# EAGLE design F3N-ADXL377-BREAKOUT (EAGLE 6.5.0)
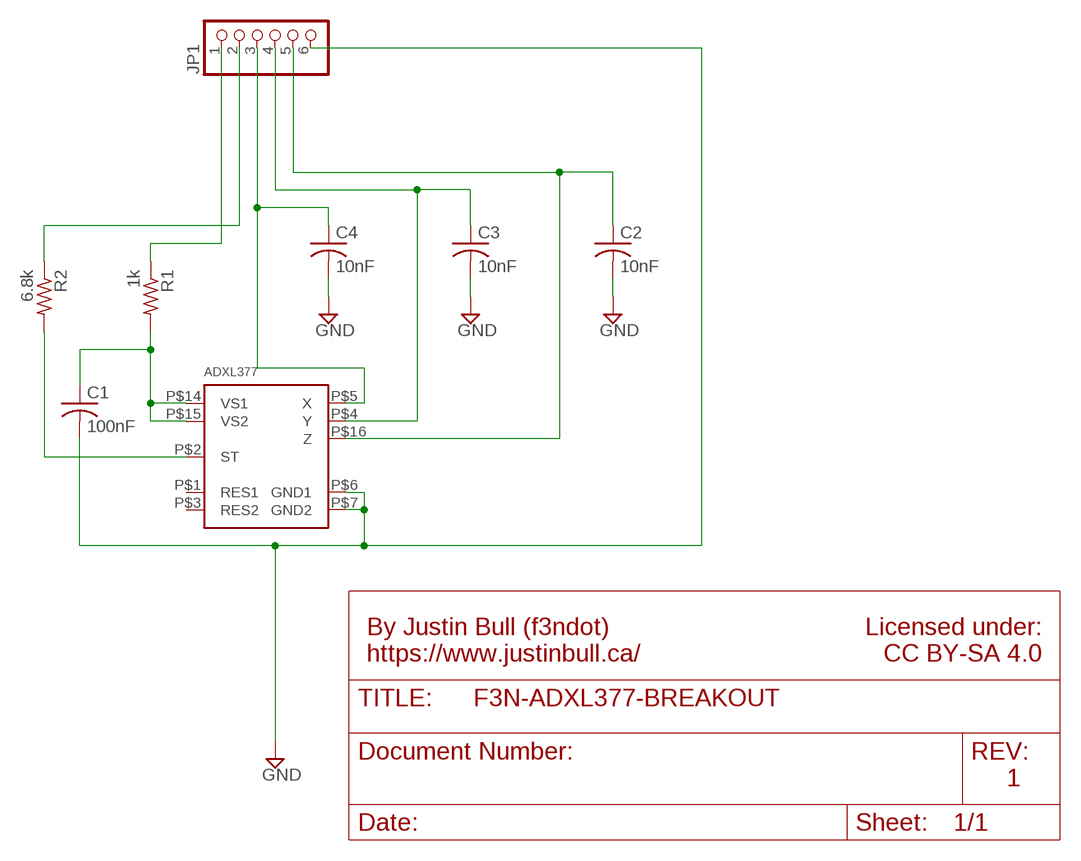
[diagram p0: schematic, sheet 1]

## Parts
ADXL377  ACCEL_ADXL377LFCSP_LQ  [LFCSP_LQ_CP-16-28]
C1  100nF  C-US050-030X075  [C050-030X075]
C2  10nF  C-US050-030X075  [C050-030X075]
C3  10nF  C-US050-030X075  [C050-030X075]
C4  10nF  C-US050-030X075  [C050-030X075]
JP1  PINHD-1X6  [1X06]
R1  1k  R-US_0204/7  [0204/7]
R2  6.8k  R-US_0204/7  [0204/7]

## Nets
GND: ADXL377.P$6(GND1) ADXL377.P$7(GND2) C1.2 C2.2 C3.2 C4.2 JP1.6
N$4: ADXL377.P$14(VS1) ADXL377.P$15(VS2) C1.1 R1.2
N$9: ADXL377.P$2(ST) R2.2
ST: JP1.2 R2.1
VS: JP1.1 R1.1
X: ADXL377.P$5(X) C4.1 JP1.3
Y: ADXL377.P$4(Y) C3.1 JP1.4
Z: ADXL377.P$16(Z) C2.1 JP1.5
Unconnected: ADXL377.P$1(RES1) ADXL377.P$3(RES2)

## Notes on the sheet
- By Justin Bull (f3ndot)
  https://www.justinbull.ca/
- Licensed under:
  CC BY-SA 4.0
- 1

## Library data of the parts
ADXL377 = adxl377:ACCEL_ADXL377: ADXL377 LFCSP_LQ (CP-16-28) From Analog Devices. Datasheet <http://www.analog.com/static/imported-files/data_sheets/ADXL377.pdf>
C1-C4 = rcl:C-US: CAPACITOR, American symbol
JP1 = adafruit:PINHD-1X6: PIN HEADER
R1 R2 = adafruit:R-US_: RESISTOR, American symbol

## Board
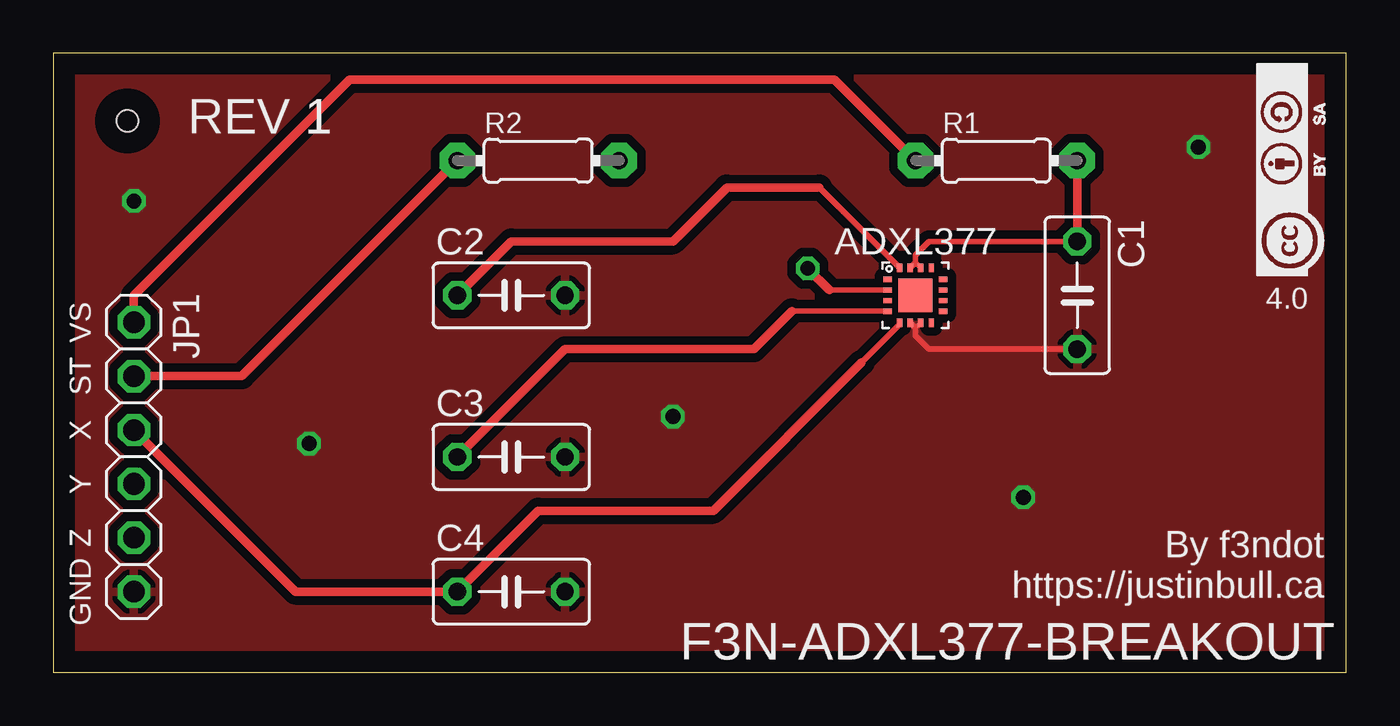
[diagram p1: board, top side]
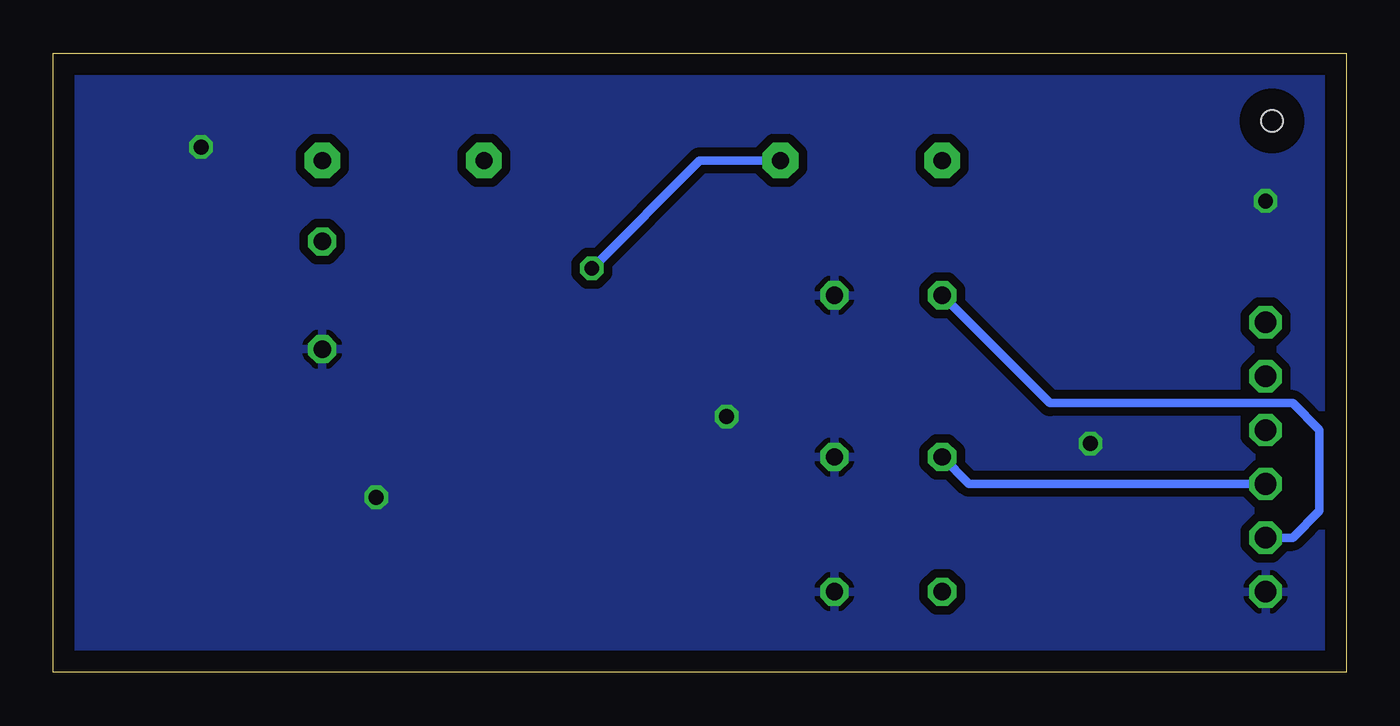
[diagram p2: board, bottom side, seen from below]

Size 60.95 x 29.2 mm. Coordinates in mm from the lower left corner, seen from the top.
Outline: 0,0 60.95,0 60.95,29.2 0,29.2 0,0
Copper layers (1*16): Top 0.035mm / dielectric 1.5mm / Bottom 0.035mm
Design rules "default": minimum track width 10mil, minimum drill 24mil, track to track 8mil, track to pad 8mil, pad to pad 8mil, via to via 8mil, smd to smd 8mil, copper to edge 40mil, drill to drill 8mil, minimum pad ring 10mil, minimum via ring 8mil, stop-mask expansion 4mil, vias tented up to drill 0mil, thermal gap 10mil
Holes 1 mm at 3.5,26

### Footprints (pad centres in the part's own frame; a part is rotated, then mirrored left to right if it is on the bottom)
LFCSP_LQ_CP-16-28 = smd 1.6 x 1.6: EXP 0,0 | smd 0.4 x 0.25: P$1 -1.3,0.75; P$2 -1.3,0.25; P$3 -1.3,-0.25; P$4 -1.3,-0.75; P$9 1.3,-0.75; P$10 1.3,-0.25; P$11 1.3,0.25; P$12 1.3,0.75 | smd 0.25 x 0.4: P$5 -0.75,-1.3; P$6 -0.25,-1.3; P$7 0.25,-1.3; P$8 0.75,-1.3; P$13 0.75,1.3; P$14 0.25,1.3; P$15 -0.25,1.3; P$16 -0.75,1.3
C050-030X075 = drill 0.813 octagon: 1 -2.54,0; 2 2.54,0
1X06 = drill 1.016 octagon: 1 -6.35,0; 2 -3.81,0; 3 -1.27,0; 4 1.27,0; 5 3.81,0; 6 6.35,0
0204/7 = drill 0.813 pad 1.676 octagon: 1 -3.81,0; 2 3.81,0

### Placement (x,y rotation side)
ADXL377  40.64,17.78 0 top
C1  48.26,17.78 270 top
C2  21.59,17.78 0 top
C3  21.59,10.16 0 top
C4  21.59,3.81 0 top
JP1  3.81,10.16 270 top
R1  44.45,24.13 0 top
R2  22.86,24.13 0 top

### Tracks (layer width: path | path; a pad name or v marks a point on that pad's centre or on a via)
GND  (via drill 0.7)
  Top 0.254: C1.2 41.27,15.24 40.64,15.88 40.64,16.23 | 40.64,16.23 ADXL377.P$6 | ADXL377.P$7 40.64,16.23
  other vias: 3.81,22.23 53.98,24.77 45.72,8.26 29.21,12.06 12.06,10.79
  pour Top (isolate 0.406): 0,29.21 60.96,29.21 60.96,0 0,0
  pour Bottom (isolate 0.406): 0,29.21 60.96,29.21 60.96,0 0,0
N$4
  Top 0.254: ADXL377.P$15 40.64,19.33 | C1.1 41.27,20.32 40.64,19.68 40.64,19.33 | ADXL377.P$14 40.64,19.33
  Top 0.406: R1.2 C1.1
N$9  (via drill 0.7)
  Top 0.254: 36.58,18.03 ADXL377.P$2
  Top 0.406: 36.58,18.03 v35.56,19.05
  Bottom 0.406: R2.2 30.48,24.13 v35.56,19.05
ST
  Top 0.406: JP1.2 8.89,13.97 R2.1
VS
  Top 0.406: JP1.1 3.81,17.78 13.97,27.94 36.83,27.94 R1.1
X
  Top 0.254: 38.1,14.61 39.89,16.39 ADXL377.P$5
  Top 0.406: 38.1,14.61 31.11,7.62 22.86,7.62 C4.1 11.43,3.81 JP1.3
Y
  Top 0.254: 34.81,17.03 ADXL377.P$4
  Top 0.406: C3.1 24.13,15.24 33.02,15.24 34.81,17.03
  Bottom 0.406: JP1.4 17.78,8.89 C3.1
Z
  Top 0.254: 36.11,22.86 ADXL377.P$16
  Top 0.406: C2.1 21.59,20.32 29.21,20.32 31.75,22.86 36.11,22.86
  Bottom 0.406: JP1.5 2.54,6.35 1.27,7.62 1.27,11.43 2.54,12.7 13.97,12.7 C2.1

### Text on the board
tPlace: REV 1 | 4.0 | By f3ndot / https://justinbull.ca | F3N-ADXL377-BREAKOUT
tNames: VS | ST | X | Y | Z | GND